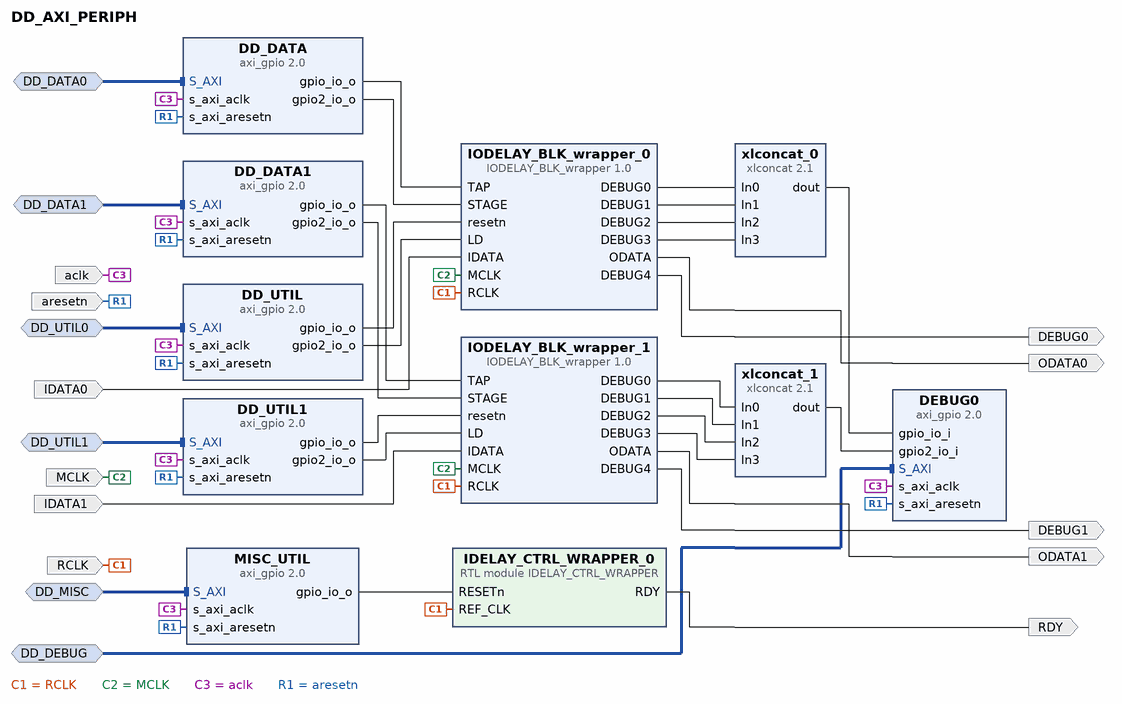
[diagram p0: block diagram of the top level]
# Vivado block design DD_AXI_PERIPH, xc7z020clg400-1, Vivado 2019.1
create_bd_design DD_AXI_PERIPH

create_bd_intf_port -mode Slave -vlnv xilinx.com:interface:aximm_tlm:1.0 DD_DATA0
create_bd_intf_port -mode Slave -vlnv xilinx.com:interface:aximm_tlm:1.0 DD_UTIL0
create_bd_intf_port -mode Slave -vlnv xilinx.com:interface:aximm_tlm:1.0 DD_DATA1
create_bd_intf_port -mode Slave -vlnv xilinx.com:interface:aximm_tlm:1.0 DD_UTIL1
create_bd_intf_port -mode Slave -vlnv xilinx.com:interface:aximm_tlm:1.0 DD_MISC
create_bd_intf_port -mode Slave -vlnv xilinx.com:interface:aximm_tlm:1.0 DD_DEBUG
create_bd_port -dir I -type clk MCLK
set_property -dict {CONFIG.FREQ_HZ 460000000} [get_bd_ports MCLK]
create_bd_port -dir I -type clk RCLK
set_property -dict {CONFIG.FREQ_HZ 310000000} [get_bd_ports RCLK]
create_bd_port -dir I IDATA0
create_bd_port -dir O ODATA0
create_bd_port -dir I aclk
create_bd_port -dir I aresetn
create_bd_port -dir I IDATA1
create_bd_port -dir O ODATA1
create_bd_port -dir O RDY
create_bd_port -dir O DEBUG0
create_bd_port -dir O DEBUG1

create_bd_cell -type ip -vlnv xilinx.com:ip:axi_gpio:2.0 DD_DATA
set_property -dict [list \
  CONFIG.C_ALL_OUTPUTS 1 \
  CONFIG.C_ALL_OUTPUTS_2 1 \
  CONFIG.C_GPIO2_WIDTH 4 \
  CONFIG.C_GPIO_WIDTH 5 \
  CONFIG.C_IS_DUAL 1 \
] [get_bd_cells DD_DATA]
create_bd_cell -type ip -vlnv xilinx.com:ip:axi_gpio:2.0 DD_UTIL
set_property -dict [list \
  CONFIG.C_ALL_OUTPUTS 1 \
  CONFIG.C_ALL_OUTPUTS_2 1 \
  CONFIG.C_DOUT_DEFAULT_2 0x00000001 \
  CONFIG.C_GPIO2_WIDTH 1 \
  CONFIG.C_GPIO_WIDTH 1 \
  CONFIG.C_IS_DUAL 1 \
] [get_bd_cells DD_UTIL]
create_bd_cell -type ip -vlnv xilinx.com:ip:axi_gpio:2.0 DD_DATA1
set_property -dict [list \
  CONFIG.C_ALL_OUTPUTS 1 \
  CONFIG.C_ALL_OUTPUTS_2 1 \
  CONFIG.C_GPIO2_WIDTH 4 \
  CONFIG.C_GPIO_WIDTH 5 \
  CONFIG.C_IS_DUAL 1 \
] [get_bd_cells DD_DATA1]
create_bd_cell -type ip -vlnv xilinx.com:ip:axi_gpio:2.0 DD_UTIL1
set_property -dict [list \
  CONFIG.C_ALL_OUTPUTS 1 \
  CONFIG.C_ALL_OUTPUTS_2 1 \
  CONFIG.C_DOUT_DEFAULT_2 0x00000001 \
  CONFIG.C_GPIO2_WIDTH 1 \
  CONFIG.C_GPIO_WIDTH 1 \
  CONFIG.C_IS_DUAL 1 \
] [get_bd_cells DD_UTIL1]
create_bd_cell -type module -reference IDELAY_CTRL_WRAPPER IDELAY_CTRL_WRAPPER_0
create_bd_cell -type ip -vlnv xilinx.com:ip:axi_gpio:2.0 MISC_UTIL
set_property -dict {CONFIG.C_ALL_OUTPUTS 1 CONFIG.C_GPIO_WIDTH 1} [get_bd_cells MISC_UTIL]
create_bd_cell -type ip -vlnv xilinx.com:ip:axi_gpio:2.0 DEBUG0
set_property -dict [list \
  CONFIG.C_ALL_INPUTS 1 \
  CONFIG.C_ALL_INPUTS_2 1 \
  CONFIG.C_GPIO2_WIDTH 20 \
  CONFIG.C_GPIO_WIDTH 20 \
  CONFIG.C_IS_DUAL 1 \
] [get_bd_cells DEBUG0]
create_bd_cell -type ip -vlnv xilinx.com:ip:xlconcat:2.1 xlconcat_0
set_property -dict [list \
  CONFIG.IN0_WIDTH 5 \
  CONFIG.IN1_WIDTH 5 \
  CONFIG.IN2_WIDTH 5 \
  CONFIG.IN3_WIDTH 5 \
  CONFIG.NUM_PORTS 4 \
] [get_bd_cells xlconcat_0]
create_bd_cell -type ip -vlnv xilinx.com:ip:xlconcat:2.1 xlconcat_1
set_property -dict [list \
  CONFIG.IN0_WIDTH 5 \
  CONFIG.IN1_WIDTH 5 \
  CONFIG.IN2_WIDTH 5 \
  CONFIG.IN3_WIDTH 5 \
  CONFIG.NUM_PORTS 4 \
] [get_bd_cells xlconcat_1]
create_bd_cell -type ip -vlnv cri.nz:user:IODELAY_BLK_wrapper:1.0 IODELAY_BLK_wrapper_0
create_bd_cell -type ip -vlnv cri.nz:user:IODELAY_BLK_wrapper:1.0 IODELAY_BLK_wrapper_1

# ---- connections ----

connect_bd_intf_net [get_bd_intf_ports DD_MISC] [get_bd_intf_pins MISC_UTIL/S_AXI]
connect_bd_intf_net [get_bd_intf_ports DD_UTIL0] [get_bd_intf_pins DD_UTIL/S_AXI]
connect_bd_intf_net -intf_net DD_DATA1_1 [get_bd_intf_ports DD_DATA1] [get_bd_intf_pins DD_DATA1/S_AXI]
connect_bd_intf_net [get_bd_intf_ports DD_DEBUG] [get_bd_intf_pins DEBUG0/S_AXI]
connect_bd_intf_net [get_bd_intf_ports DD_DATA0] [get_bd_intf_pins DD_DATA/S_AXI]
connect_bd_intf_net -intf_net DD_UTIL1_1 [get_bd_intf_ports DD_UTIL1] [get_bd_intf_pins DD_UTIL1/S_AXI]
connect_bd_net -net axi_gpio_0_gpio_io_o [get_bd_pins DD_DATA/gpio_io_o] [get_bd_pins IODELAY_BLK_wrapper_0/TAP]
connect_bd_net -net axi_gpio_0_gpio2_io_o [get_bd_pins DD_DATA/gpio2_io_o] [get_bd_pins IODELAY_BLK_wrapper_0/STAGE]
connect_bd_net -net axi_gpio_0_gpio_io_o1 [get_bd_pins DD_UTIL/gpio_io_o] [get_bd_pins IODELAY_BLK_wrapper_0/resetn]
connect_bd_net -net axi_gpio_0_gpio2_io_o1 [get_bd_pins DD_UTIL/gpio2_io_o] [get_bd_pins IODELAY_BLK_wrapper_0/LD]
connect_bd_net [get_bd_ports RCLK] \
  [get_bd_pins IDELAY_CTRL_WRAPPER_0/REF_CLK] [get_bd_pins IODELAY_BLK_wrapper_0/RCLK] \
  [get_bd_pins IODELAY_BLK_wrapper_1/RCLK]
connect_bd_net [get_bd_ports MCLK] [get_bd_pins IODELAY_BLK_wrapper_0/MCLK] [get_bd_pins IODELAY_BLK_wrapper_1/MCLK]
connect_bd_net [get_bd_ports IDATA0] [get_bd_pins IODELAY_BLK_wrapper_0/IDATA]
connect_bd_net [get_bd_pins IODELAY_BLK_wrapper_0/ODATA] [get_bd_ports ODATA0]
connect_bd_net [get_bd_ports aclk] \
  [get_bd_pins DD_UTIL/s_axi_aclk] [get_bd_pins DD_DATA/s_axi_aclk] [get_bd_pins DD_UTIL1/s_axi_aclk] \
  [get_bd_pins DD_DATA1/s_axi_aclk] [get_bd_pins MISC_UTIL/s_axi_aclk] [get_bd_pins DEBUG0/s_axi_aclk]
connect_bd_net [get_bd_ports aresetn] \
  [get_bd_pins DD_UTIL/s_axi_aresetn] [get_bd_pins DD_DATA/s_axi_aresetn] [get_bd_pins DD_UTIL1/s_axi_aresetn] \
  [get_bd_pins DD_DATA1/s_axi_aresetn] [get_bd_pins MISC_UTIL/s_axi_aresetn] [get_bd_pins DEBUG0/s_axi_aresetn]
connect_bd_net [get_bd_pins DD_DATA1/gpio_io_o] [get_bd_pins IODELAY_BLK_wrapper_1/TAP]
connect_bd_net [get_bd_pins DD_DATA1/gpio2_io_o] [get_bd_pins IODELAY_BLK_wrapper_1/STAGE]
connect_bd_net [get_bd_pins DD_UTIL1/gpio_io_o] [get_bd_pins IODELAY_BLK_wrapper_1/resetn]
connect_bd_net [get_bd_pins DD_UTIL1/gpio2_io_o] [get_bd_pins IODELAY_BLK_wrapper_1/LD]
connect_bd_net -net IDATA1_1 [get_bd_ports IDATA1] [get_bd_pins IODELAY_BLK_wrapper_1/IDATA]
connect_bd_net [get_bd_pins IODELAY_BLK_wrapper_1/ODATA] [get_bd_ports ODATA1]
connect_bd_net [get_bd_pins IDELAY_CTRL_WRAPPER_0/RDY] [get_bd_ports RDY]
connect_bd_net [get_bd_pins MISC_UTIL/gpio_io_o] [get_bd_pins IDELAY_CTRL_WRAPPER_0/RESETn]
connect_bd_net [get_bd_pins IODELAY_BLK_wrapper_0/DEBUG0] [get_bd_pins xlconcat_0/In0]
connect_bd_net [get_bd_pins IODELAY_BLK_wrapper_0/DEBUG1] [get_bd_pins xlconcat_0/In1]
connect_bd_net [get_bd_pins IODELAY_BLK_wrapper_0/DEBUG2] [get_bd_pins xlconcat_0/In2]
connect_bd_net [get_bd_pins IODELAY_BLK_wrapper_0/DEBUG3] [get_bd_pins xlconcat_0/In3]
connect_bd_net [get_bd_pins xlconcat_0/dout] [get_bd_pins DEBUG0/gpio_io_i]
connect_bd_net [get_bd_pins IODELAY_BLK_wrapper_1/DEBUG0] [get_bd_pins xlconcat_1/In0]
connect_bd_net [get_bd_pins IODELAY_BLK_wrapper_1/DEBUG1] [get_bd_pins xlconcat_1/In1]
connect_bd_net [get_bd_pins IODELAY_BLK_wrapper_1/DEBUG2] [get_bd_pins xlconcat_1/In2]
connect_bd_net [get_bd_pins IODELAY_BLK_wrapper_1/DEBUG3] [get_bd_pins xlconcat_1/In3]
connect_bd_net [get_bd_pins xlconcat_1/dout] [get_bd_pins DEBUG0/gpio2_io_i]
connect_bd_net [get_bd_pins IODELAY_BLK_wrapper_0/DEBUG4] [get_bd_ports DEBUG0]
connect_bd_net [get_bd_pins IODELAY_BLK_wrapper_1/DEBUG4] [get_bd_ports DEBUG1]

validate_bd_design
save_bd_design
